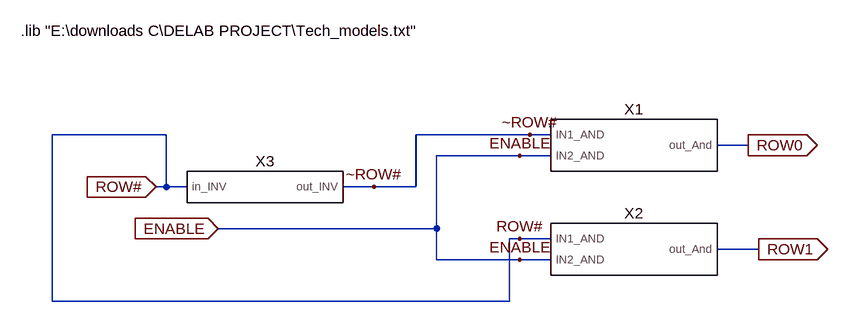
[diagram p0: schematic dec21.asc]
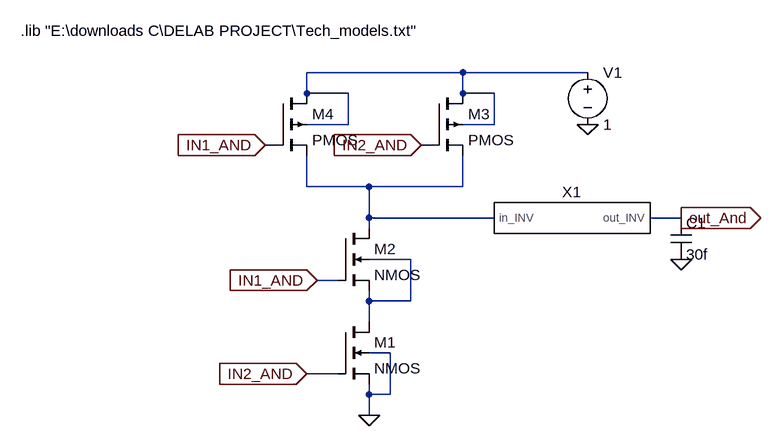
[diagram p1: sub-circuit gate_andd.asc]
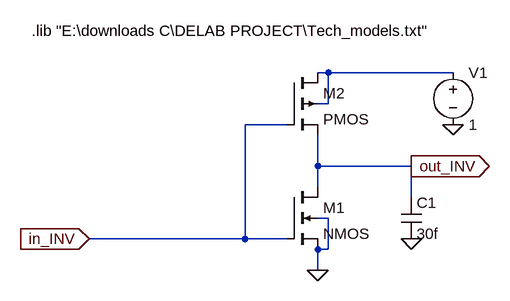
[diagram p2: sub-circuit gate_invv.asc]
dec21.asc, the LTspice schematic file:
Version 4
SHEET 1 880 680
WIRE -336 32 -512 32
WIRE 224 32 48 32
WIRE 256 32 224 32
WIRE 560 48 512 48
WIRE 208 64 80 64
WIRE 256 64 208 64
WIRE -336 112 -336 32
WIRE -336 112 -352 112
WIRE -304 112 -336 112
WIRE -16 112 -64 112
WIRE 48 112 48 32
WIRE 48 112 -16 112
WIRE 80 176 80 64
WIRE 80 176 -256 176
WIRE 208 192 192 192
WIRE 256 192 208 192
WIRE 576 208 512 208
WIRE 80 224 80 176
WIRE 208 224 80 224
WIRE 256 224 208 224
WIRE -512 288 -512 32
WIRE 192 288 192 192
WIRE 192 288 -512 288
FLAG -256 176 ENABLE
IOPIN -256 176 In
FLAG -352 112 ROW#
IOPIN -352 112 In
FLAG -16 112 ~ROW#
FLAG 224 32 ~ROW#
FLAG 208 192 ROW#
FLAG 208 224 ENABLE
FLAG 208 64 ENABLE
FLAG 560 48 ROW0
IOPIN 560 48 Out
FLAG 576 208 ROW1
IOPIN 576 208 Out
SYMBOL gate_andd 384 48 R0
SYMATTR InstName X1
SYMBOL gate_andd 384 208 R0
SYMATTR InstName X2
SYMBOL gate_invv -192 112 R0
SYMATTR InstName X3
TEXT -560 -128 Left 2 !.lib "E:\\downloads C\\DELAB PROJECT\\Tech_models.txt"

gate_andd.asc, the sub-circuit schematic file:
Version 4
SHEET 1 880 680
WIRE 352 -160 112 -160
WIRE 544 -160 352 -160
WIRE 112 -128 112 -160
WIRE 176 -128 112 -128
WIRE 352 -128 352 -160
WIRE 400 -128 352 -128
WIRE 176 -80 176 -128
WIRE 176 -80 112 -80
WIRE 400 -80 400 -128
WIRE 400 -80 352 -80
WIRE 64 -48 48 -48
WIRE 304 -48 288 -48
WIRE 112 16 112 -32
WIRE 208 16 112 16
WIRE 352 16 352 -32
WIRE 352 16 208 16
WIRE 208 64 208 16
WIRE 400 64 208 64
WIRE 688 64 640 64
WIRE 208 80 208 64
WIRE 272 128 208 128
WIRE 160 160 128 160
WIRE 208 192 208 176
WIRE 272 192 272 128
WIRE 272 192 208 192
WIRE 208 224 208 192
WIRE 240 272 208 272
WIRE 160 304 112 304
WIRE 208 336 208 320
WIRE 240 336 240 272
WIRE 240 336 208 336
WIRE 208 368 208 336
FLAG 208 368 0
FLAG 544 -80 0
FLAG 48 -48 IN1_AND
IOPIN 48 -48 In
FLAG 288 -48 IN2_AND
IOPIN 288 -48 In
FLAG 688 128 0
FLAG 688 64 out_And
IOPIN 688 64 Out
FLAG 128 160 IN1_AND
IOPIN 128 160 In
FLAG 112 304 IN2_AND
IOPIN 112 304 In
SYMBOL nmos4 160 224 R0
SYMATTR InstName M1
SYMATTR Value2 l=32n w=64n
SYMBOL nmos4 160 80 R0
SYMATTR InstName M2
SYMATTR Value2 l=32n w=64n
SYMBOL pmos4 304 -128 R0
SYMATTR InstName M3
SYMATTR Value2 l=32n w=128n
SYMBOL pmos4 64 -128 R0
SYMATTR InstName M4
SYMATTR Value2 l=32n w=128n
SYMBOL voltage 544 -176 R0
WINDOW 123 0 0 Left 0
WINDOW 39 0 0 Left 0
SYMATTR InstName V1
SYMATTR Value 1
SYMBOL gate_invv 512 64 R0
SYMATTR InstName X1
SYMBOL cap 672 64 R0
SYMATTR InstName C1
SYMATTR Value 30f
TEXT -328 -224 Left 2 !.lib "E:\\downloads C\\DELAB PROJECT\\Tech_models.txt"

gate_invv.asc, the sub-circuit schematic file:
Version 4
SHEET 1 880 680
WIRE 240 32 224 32
WIRE 432 32 240 32
WIRE 240 80 240 32
WIRE 240 80 224 80
WIRE 176 112 112 112
WIRE 224 176 224 128
WIRE 368 176 224 176
WIRE 224 208 224 176
WIRE 368 224 368 176
WIRE 240 256 224 256
WIRE 112 288 112 112
WIRE 112 288 -128 288
WIRE 176 288 112 288
WIRE 240 304 240 256
WIRE 240 304 224 304
WIRE 224 336 224 304
FLAG 224 336 0
FLAG 432 112 0
FLAG -128 288 in_INV
IOPIN -128 288 In
FLAG 368 176 out_INV
IOPIN 368 176 Out
FLAG 368 288 0
SYMBOL nmos4 176 208 R0
SYMATTR InstName M1
SYMATTR Value2 l=32n w=64n
SYMBOL pmos4 176 32 R0
SYMATTR InstName M2
SYMATTR Value2 l=32n w=128n
SYMBOL voltage 432 16 R0
WINDOW 123 0 0 Left 0
WINDOW 39 0 0 Left 0
SYMATTR InstName V1
SYMATTR Value 1
SYMBOL cap 352 224 R0
SYMATTR InstName C1
SYMATTR Value 30f
TEXT -216 -32 Left 2 !.lib "E:\\downloads C\\DELAB PROJECT\\Tech_models.txt"

The netlist it stands for:
* dec21.asc
XX1 ~ROW# ENABLE ROW0 gate_andd
XX2 ROW# ENABLE ROW1 gate_andd
XX3 ROW# ~ROW# gate_invv

* block symbol definitions
.subckt gate_andd IN1_AND IN2_AND out_And
M1 N003 IN2_AND 0 0 NMOS l=32n w=64n
M2 N002 IN1_AND N003 N003 NMOS l=32n w=64n
M3 N001 IN2_AND N002 N001 PMOS l=32n w=128n
M4 N001 IN1_AND N002 N001 PMOS l=32n w=128n
V1 N001 0 1
XX1 N002 out_And gate_invv
C1 out_And 0 30f
.lib "E:\downloads C\DELAB PROJECT\Tech_models.txt"
.ends gate_andd

.subckt gate_invv in_INV out_INV
M1 out_INV in_INV 0 0 NMOS l=32n w=64n
M2 N001 in_INV out_INV N001 PMOS l=32n w=128n
V1 N001 0 1
C1 out_INV 0 30f
.lib "E:\downloads C\DELAB PROJECT\Tech_models.txt"
.ends gate_invv

.model NMOS NMOS
.model PMOS PMOS
.lib standard.mos
.lib "E:\downloads C\DELAB PROJECT\Tech_models.txt"
.backanno
.end